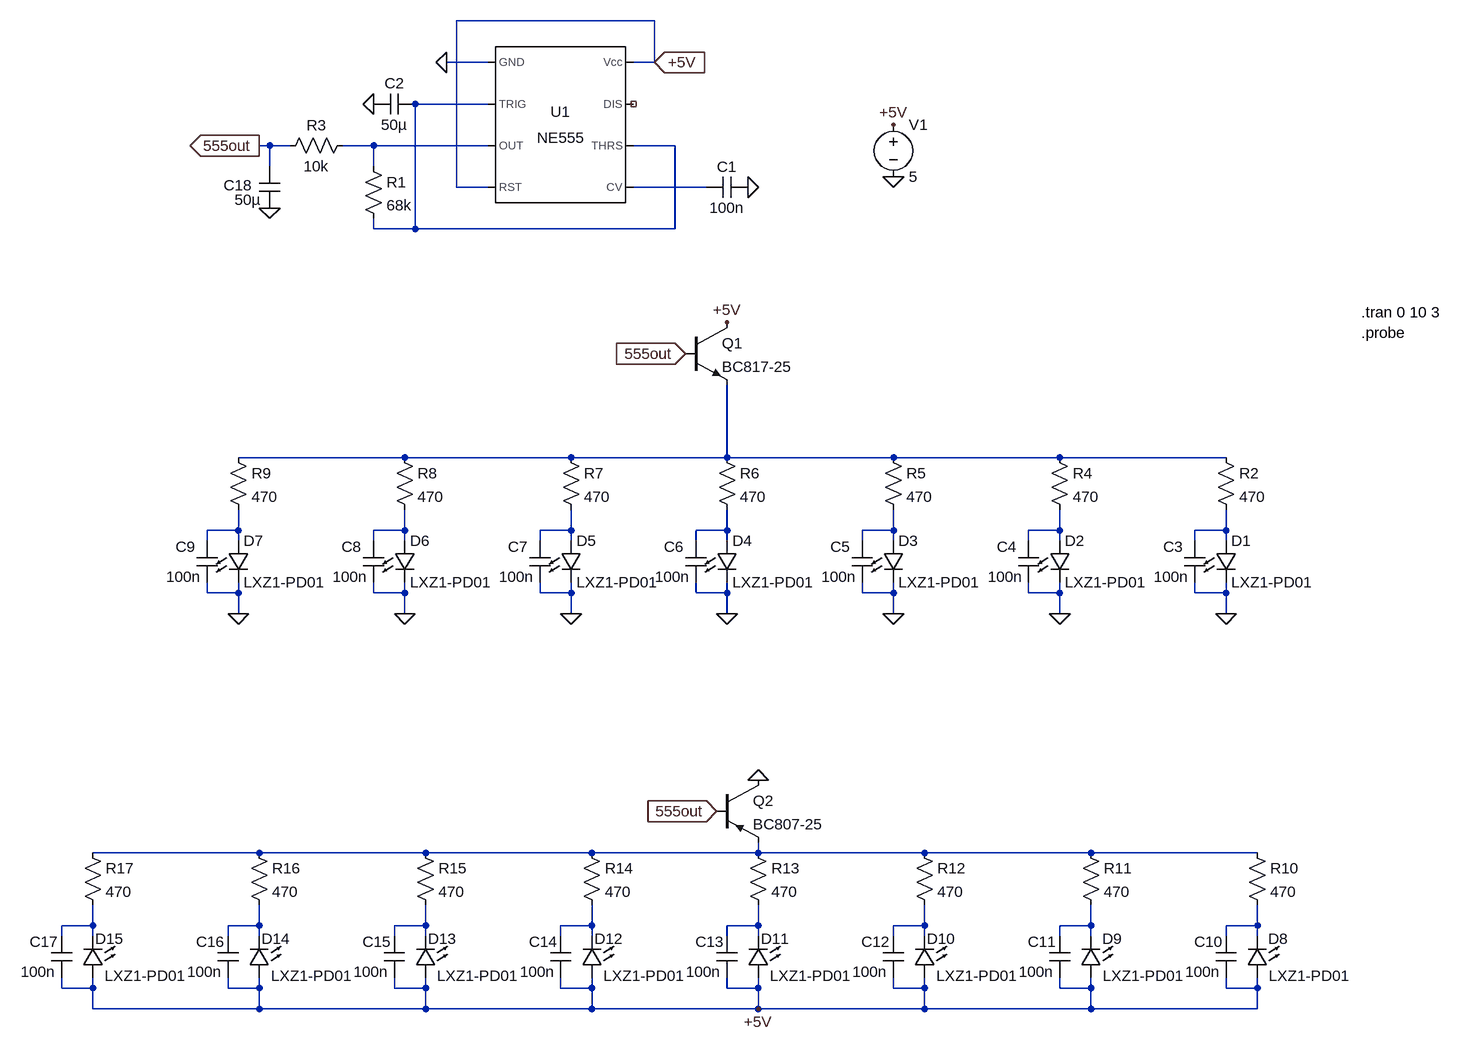
[diagram p0: schematic palemka.asc]
palemka.asc, the LTspice schematic file:
Version 4
SHEET 1 880 1164
WIRE -1968 -416 -2272 -416
WIRE -2224 -352 -2288 -352
WIRE -1968 -352 -1968 -416
WIRE -1968 -352 -2000 -352
WIRE -2224 -288 -2336 -288
WIRE -2560 -224 -2576 -224
WIRE -2528 -224 -2560 -224
WIRE -2400 -224 -2448 -224
WIRE -2224 -224 -2400 -224
WIRE -1936 -224 -2000 -224
WIRE -2560 -192 -2560 -224
WIRE -2400 -192 -2400 -224
WIRE -2272 -160 -2272 -416
WIRE -2224 -160 -2272 -160
WIRE -1888 -160 -2000 -160
WIRE -2400 -96 -2400 -112
WIRE -2336 -96 -2336 -288
WIRE -2336 -96 -2400 -96
WIRE -1936 -96 -1936 -224
WIRE -1936 -96 -2336 -96
WIRE -2352 256 -2608 256
WIRE -2096 256 -2352 256
WIRE -1856 256 -1856 144
WIRE -1856 256 -2096 256
WIRE -1600 256 -1856 256
WIRE -1344 256 -1600 256
WIRE -1088 256 -1344 256
WIRE -2608 368 -2608 336
WIRE -2608 368 -2656 368
WIRE -2352 368 -2352 336
WIRE -2352 368 -2400 368
WIRE -2096 368 -2096 336
WIRE -2096 368 -2144 368
WIRE -1856 368 -1856 336
WIRE -1856 368 -1904 368
WIRE -1600 368 -1600 336
WIRE -1600 368 -1648 368
WIRE -1344 368 -1344 336
WIRE -1344 368 -1392 368
WIRE -1088 368 -1088 336
WIRE -1088 368 -1136 368
WIRE -2656 384 -2656 368
WIRE -2608 384 -2608 368
WIRE -2400 384 -2400 368
WIRE -2352 384 -2352 368
WIRE -2144 384 -2144 368
WIRE -2096 384 -2096 368
WIRE -1904 384 -1904 368
WIRE -1856 384 -1856 368
WIRE -1648 384 -1648 368
WIRE -1600 384 -1600 368
WIRE -1392 384 -1392 368
WIRE -1344 384 -1344 368
WIRE -1136 384 -1136 368
WIRE -1088 384 -1088 368
WIRE -2656 464 -2656 448
WIRE -2608 464 -2608 448
WIRE -2608 464 -2656 464
WIRE -2400 464 -2400 448
WIRE -2352 464 -2352 448
WIRE -2352 464 -2400 464
WIRE -2144 464 -2144 448
WIRE -2096 464 -2096 448
WIRE -2096 464 -2144 464
WIRE -1904 464 -1904 448
WIRE -1856 464 -1856 448
WIRE -1856 464 -1904 464
WIRE -1648 464 -1648 448
WIRE -1600 464 -1600 448
WIRE -1600 464 -1648 464
WIRE -1392 464 -1392 448
WIRE -1344 464 -1344 448
WIRE -1344 464 -1392 464
WIRE -1136 464 -1136 448
WIRE -1088 464 -1088 448
WIRE -1088 464 -1136 464
WIRE -2608 496 -2608 464
WIRE -2352 496 -2352 464
WIRE -2096 496 -2096 464
WIRE -1856 496 -1856 464
WIRE -1600 496 -1600 464
WIRE -1344 496 -1344 464
WIRE -1088 496 -1088 464
WIRE -2576 864 -2832 864
WIRE -2320 864 -2576 864
WIRE -2064 864 -2320 864
WIRE -1808 864 -1808 848
WIRE -1808 864 -2064 864
WIRE -1552 864 -1808 864
WIRE -1296 864 -1552 864
WIRE -1040 864 -1296 864
WIRE -2832 976 -2832 944
WIRE -2832 976 -2880 976
WIRE -2576 976 -2576 944
WIRE -2576 976 -2624 976
WIRE -2320 976 -2320 944
WIRE -2320 976 -2368 976
WIRE -2064 976 -2064 944
WIRE -2064 976 -2112 976
WIRE -1808 976 -1808 944
WIRE -1808 976 -1856 976
WIRE -1552 976 -1552 944
WIRE -1552 976 -1600 976
WIRE -1296 976 -1296 944
WIRE -1296 976 -1344 976
WIRE -1040 976 -1040 944
WIRE -1040 976 -1088 976
WIRE -2880 992 -2880 976
WIRE -2832 992 -2832 976
WIRE -2624 992 -2624 976
WIRE -2576 992 -2576 976
WIRE -2368 992 -2368 976
WIRE -2320 992 -2320 976
WIRE -2112 992 -2112 976
WIRE -2064 992 -2064 976
WIRE -1856 992 -1856 976
WIRE -1808 992 -1808 976
WIRE -1600 992 -1600 976
WIRE -1552 992 -1552 976
WIRE -1344 992 -1344 976
WIRE -1296 992 -1296 976
WIRE -1088 992 -1088 976
WIRE -1040 992 -1040 976
WIRE -2880 1072 -2880 1056
WIRE -2832 1072 -2832 1056
WIRE -2832 1072 -2880 1072
WIRE -2624 1072 -2624 1056
WIRE -2576 1072 -2576 1056
WIRE -2576 1072 -2624 1072
WIRE -2368 1072 -2368 1056
WIRE -2320 1072 -2320 1056
WIRE -2320 1072 -2368 1072
WIRE -2112 1072 -2112 1056
WIRE -2064 1072 -2064 1056
WIRE -2064 1072 -2112 1072
WIRE -1856 1072 -1856 1056
WIRE -1808 1072 -1808 1056
WIRE -1808 1072 -1856 1072
WIRE -1600 1072 -1600 1056
WIRE -1552 1072 -1552 1056
WIRE -1552 1072 -1600 1072
WIRE -1344 1072 -1344 1056
WIRE -1296 1072 -1296 1056
WIRE -1296 1072 -1344 1072
WIRE -1088 1072 -1088 1056
WIRE -1040 1072 -1040 1056
WIRE -1040 1072 -1088 1072
WIRE -2832 1104 -2832 1072
WIRE -2576 1104 -2576 1072
WIRE -2576 1104 -2832 1104
WIRE -2320 1104 -2320 1072
WIRE -2320 1104 -2576 1104
WIRE -2064 1104 -2064 1072
WIRE -2064 1104 -2320 1104
WIRE -1808 1104 -1808 1072
WIRE -1808 1104 -2064 1104
WIRE -1552 1104 -1552 1072
WIRE -1552 1104 -1808 1104
WIRE -1296 1104 -1296 1072
WIRE -1296 1104 -1552 1104
WIRE -1040 1104 -1040 1072
WIRE -1040 1104 -1296 1104
FLAG -2288 -352 0
FLAG -1824 -160 0
FLAG -2576 -224 555out
IOPIN -2576 -224 Out
FLAG -1600 -176 0
FLAG -1600 -256 +5V
FLAG -1968 -352 +5V
IOPIN -1968 -352 In
FLAG -2400 -288 0
FLAG -1088 496 0
FLAG -1344 496 0
FLAG -1600 496 0
FLAG -1856 496 0
FLAG -2096 496 0
FLAG -2352 496 0
FLAG -2608 496 0
FLAG -1920 96 555out
IOPIN -1920 96 In
FLAG -1856 48 +5V
FLAG -1808 752 0
FLAG -1872 800 555out
IOPIN -1872 800 In
FLAG -1808 1104 +5V
FLAG -2560 -128 0
SYMBOL Misc\\NE555 -2112 -256 R0
SYMATTR InstName U1
SYMBOL cap -1824 -176 R90
WINDOW 0 0 32 VBottom 2
WINDOW 3 32 32 VTop 2
SYMATTR InstName C1
SYMATTR Value 100n
SYMBOL res -2416 -208 R0
SYMATTR InstName R1
SYMATTR Value 68k
SYMBOL voltage -1600 -272 R0
WINDOW 123 0 0 Left 0
WINDOW 39 0 0 Left 0
SYMATTR InstName V1
SYMATTR Value 5
SYMBOL cap -2336 -304 R90
WINDOW 0 0 32 VBottom 2
WINDOW 3 32 32 VTop 2
SYMATTR InstName C2
SYMATTR Value 50µ
SYMBOL LED -1104 384 R0
SYMATTR InstName D1
SYMATTR Value LXZ1-PD01
SYMATTR Description Diode
SYMATTR Type diode
SYMBOL res -1104 240 R0
SYMATTR InstName R2
SYMATTR Value 470
SYMBOL npn -1920 48 R0
SYMATTR InstName Q1
SYMATTR Value BC817-25
SYMBOL pnp -1872 752 R0
SYMATTR InstName Q2
SYMATTR Value BC807-25
SYMBOL res -2432 -240 R90
WINDOW 0 0 56 VBottom 2
WINDOW 3 32 56 VTop 2
SYMATTR InstName R3
SYMATTR Value 10k
SYMBOL cap -1152 384 R0
WINDOW 0 -33 9 Left 2
WINDOW 3 -47 55 Left 2
SYMATTR InstName C3
SYMATTR Value 100n
SYMBOL LED -1360 384 R0
SYMATTR InstName D2
SYMATTR Value LXZ1-PD01
SYMATTR Description Diode
SYMATTR Type diode
SYMBOL res -1360 240 R0
SYMATTR InstName R4
SYMATTR Value 470
SYMBOL cap -1408 384 R0
WINDOW 0 -33 9 Left 2
WINDOW 3 -47 55 Left 2
SYMATTR InstName C4
SYMATTR Value 100n
SYMBOL LED -1616 384 R0
SYMATTR InstName D3
SYMATTR Value LXZ1-PD01
SYMATTR Description Diode
SYMATTR Type diode
SYMBOL res -1616 240 R0
SYMATTR InstName R5
SYMATTR Value 470
SYMBOL cap -1664 384 R0
WINDOW 0 -33 9 Left 2
WINDOW 3 -47 55 Left 2
SYMATTR InstName C5
SYMATTR Value 100n
SYMBOL LED -1872 384 R0
SYMATTR InstName D4
SYMATTR Value LXZ1-PD01
SYMATTR Description Diode
SYMATTR Type diode
SYMBOL res -1872 240 R0
SYMATTR InstName R6
SYMATTR Value 470
SYMBOL cap -1920 384 R0
WINDOW 0 -33 9 Left 2
WINDOW 3 -47 55 Left 2
SYMATTR InstName C6
SYMATTR Value 100n
SYMBOL LED -2112 384 R0
SYMATTR InstName D5
SYMATTR Value LXZ1-PD01
SYMATTR Description Diode
SYMATTR Type diode
SYMBOL res -2112 240 R0
SYMATTR InstName R7
SYMATTR Value 470
SYMBOL cap -2160 384 R0
WINDOW 0 -33 9 Left 2
WINDOW 3 -47 55 Left 2
SYMATTR InstName C7
SYMATTR Value 100n
SYMBOL LED -2368 384 R0
SYMATTR InstName D6
SYMATTR Value LXZ1-PD01
SYMATTR Description Diode
SYMATTR Type diode
SYMBOL res -2368 240 R0
SYMATTR InstName R8
SYMATTR Value 470
SYMBOL cap -2416 384 R0
WINDOW 0 -33 9 Left 2
WINDOW 3 -47 55 Left 2
SYMATTR InstName C8
SYMATTR Value 100n
SYMBOL LED -2624 384 R0
SYMATTR InstName D7
SYMATTR Value LXZ1-PD01
SYMATTR Description Diode
SYMATTR Type diode
SYMBOL res -2624 240 R0
SYMATTR InstName R9
SYMATTR Value 470
SYMBOL cap -2672 384 R0
WINDOW 0 -33 9 Left 2
WINDOW 3 -47 55 Left 2
SYMATTR InstName C9
SYMATTR Value 100n
SYMBOL res -1056 848 R0
SYMATTR InstName R10
SYMATTR Value 470
SYMBOL cap -1104 992 R0
WINDOW 0 -33 9 Left 2
WINDOW 3 -47 55 Left 2
SYMATTR InstName C10
SYMATTR Value 100n
SYMBOL LED -1024 1056 R180
WINDOW 0 -32 60 Left 2
WINDOW 3 -128 3 Left 2
SYMATTR InstName D8
SYMATTR Value LXZ1-PD01
SYMATTR Description Diode
SYMATTR Type diode
SYMBOL res -1312 848 R0
SYMATTR InstName R11
SYMATTR Value 470
SYMBOL cap -1360 992 R0
WINDOW 0 -33 9 Left 2
WINDOW 3 -47 55 Left 2
SYMATTR InstName C11
SYMATTR Value 100n
SYMBOL LED -1280 1056 R180
WINDOW 0 -32 60 Left 2
WINDOW 3 -128 3 Left 2
SYMATTR InstName D9
SYMATTR Value LXZ1-PD01
SYMATTR Description Diode
SYMATTR Type diode
SYMBOL res -1568 848 R0
SYMATTR InstName R12
SYMATTR Value 470
SYMBOL cap -1616 992 R0
WINDOW 0 -33 9 Left 2
WINDOW 3 -47 55 Left 2
SYMATTR InstName C12
SYMATTR Value 100n
SYMBOL LED -1536 1056 R180
WINDOW 0 -32 60 Left 2
WINDOW 3 -128 3 Left 2
SYMATTR InstName D10
SYMATTR Value LXZ1-PD01
SYMATTR Description Diode
SYMATTR Type diode
SYMBOL res -1824 848 R0
SYMATTR InstName R13
SYMATTR Value 470
SYMBOL cap -1872 992 R0
WINDOW 0 -33 9 Left 2
WINDOW 3 -47 55 Left 2
SYMATTR InstName C13
SYMATTR Value 100n
SYMBOL LED -1792 1056 R180
WINDOW 0 -32 60 Left 2
WINDOW 3 -128 3 Left 2
SYMATTR InstName D11
SYMATTR Value LXZ1-PD01
SYMATTR Description Diode
SYMATTR Type diode
SYMBOL res -2080 848 R0
SYMATTR InstName R14
SYMATTR Value 470
SYMBOL cap -2128 992 R0
WINDOW 0 -33 9 Left 2
WINDOW 3 -47 55 Left 2
SYMATTR InstName C14
SYMATTR Value 100n
SYMBOL LED -2048 1056 R180
WINDOW 0 -32 60 Left 2
WINDOW 3 -128 3 Left 2
SYMATTR InstName D12
SYMATTR Value LXZ1-PD01
SYMATTR Description Diode
SYMATTR Type diode
SYMBOL res -2336 848 R0
SYMATTR InstName R15
SYMATTR Value 470
SYMBOL cap -2384 992 R0
WINDOW 0 -33 9 Left 2
WINDOW 3 -47 55 Left 2
SYMATTR InstName C15
SYMATTR Value 100n
SYMBOL LED -2304 1056 R180
WINDOW 0 -32 60 Left 2
WINDOW 3 -128 3 Left 2
SYMATTR InstName D13
SYMATTR Value LXZ1-PD01
SYMATTR Description Diode
SYMATTR Type diode
SYMBOL res -2592 848 R0
SYMATTR InstName R16
SYMATTR Value 470
SYMBOL cap -2640 992 R0
WINDOW 0 -33 9 Left 2
WINDOW 3 -47 55 Left 2
SYMATTR InstName C16
SYMATTR Value 100n
SYMBOL LED -2560 1056 R180
WINDOW 0 -32 60 Left 2
WINDOW 3 -128 3 Left 2
SYMATTR InstName D14
SYMATTR Value LXZ1-PD01
SYMATTR Description Diode
SYMATTR Type diode
SYMBOL res -2848 848 R0
SYMATTR InstName R17
SYMATTR Value 470
SYMBOL cap -2896 992 R0
WINDOW 0 -33 9 Left 2
WINDOW 3 -47 55 Left 2
SYMATTR InstName C17
SYMATTR Value 100n
SYMBOL LED -2816 1056 R180
WINDOW 0 -32 60 Left 2
WINDOW 3 -128 3 Left 2
SYMATTR InstName D15
SYMATTR Value LXZ1-PD01
SYMATTR Description Diode
SYMATTR Type diode
SYMBOL cap -2576 -192 R0
WINDOW 0 -55 29 Left 2
WINDOW 3 -38 51 Left 2
SYMATTR InstName C18
SYMATTR Value 50µ
TEXT -880 32 Left 2 !.tran 0 10 3
TEXT -880 64 Left 2 !.probe

The netlist it stands for:
* palemka.asc
XU1 0 N001 N002 +5V N003 N001 NC_01 +5V NE555  ; pins GND TRIG OUT RST CV THRS DIS Vcc
C1 0 N003 100n
R1 N002 N001 68k
V1 +5V 0 5
C2 N001 0 50µ
D1 N011 0 LXZ1-PD01
R2 N004 N011 470
Q1 +5V 555out N004 0 BC817-25
Q2 0 555out N012 0 BC807-25
R3 N002 555out 10k
C3 N011 0 100n
D2 N010 0 LXZ1-PD01
R4 N004 N010 470
C4 N010 0 100n
D3 N009 0 LXZ1-PD01
R5 N004 N009 470
C5 N009 0 100n
D4 N008 0 LXZ1-PD01
R6 N004 N008 470
C6 N008 0 100n
D5 N007 0 LXZ1-PD01
R7 N004 N007 470
C7 N007 0 100n
D6 N006 0 LXZ1-PD01
R8 N004 N006 470
C8 N006 0 100n
D7 N005 0 LXZ1-PD01
R9 N004 N005 470
C9 N005 0 100n
R10 N012 N020 470
C10 N020 +5V 100n
D8 +5V N020 LXZ1-PD01
R11 N012 N019 470
C11 N019 +5V 100n
D9 +5V N019 LXZ1-PD01
R12 N012 N018 470
C12 N018 +5V 100n
D10 +5V N018 LXZ1-PD01
R13 N012 N017 470
C13 N017 +5V 100n
D11 +5V N017 LXZ1-PD01
R14 N012 N016 470
C14 N016 +5V 100n
D12 +5V N016 LXZ1-PD01
R15 N012 N015 470
C15 N015 +5V 100n
D13 +5V N015 LXZ1-PD01
R16 N012 N014 470
C16 N014 +5V 100n
D14 +5V N014 LXZ1-PD01
R17 N012 N013 470
C17 N013 +5V 100n
D15 +5V N013 LXZ1-PD01
C18 555out 0 50µ
.model D D
.lib standard.dio
.model NPN NPN
.model PNP PNP
.lib standard.bjt
.tran 0 10 3
.probe
.lib NE555.sub
.backanno
.end